# EAGLE design sensor_001 (EAGLE 4.15)
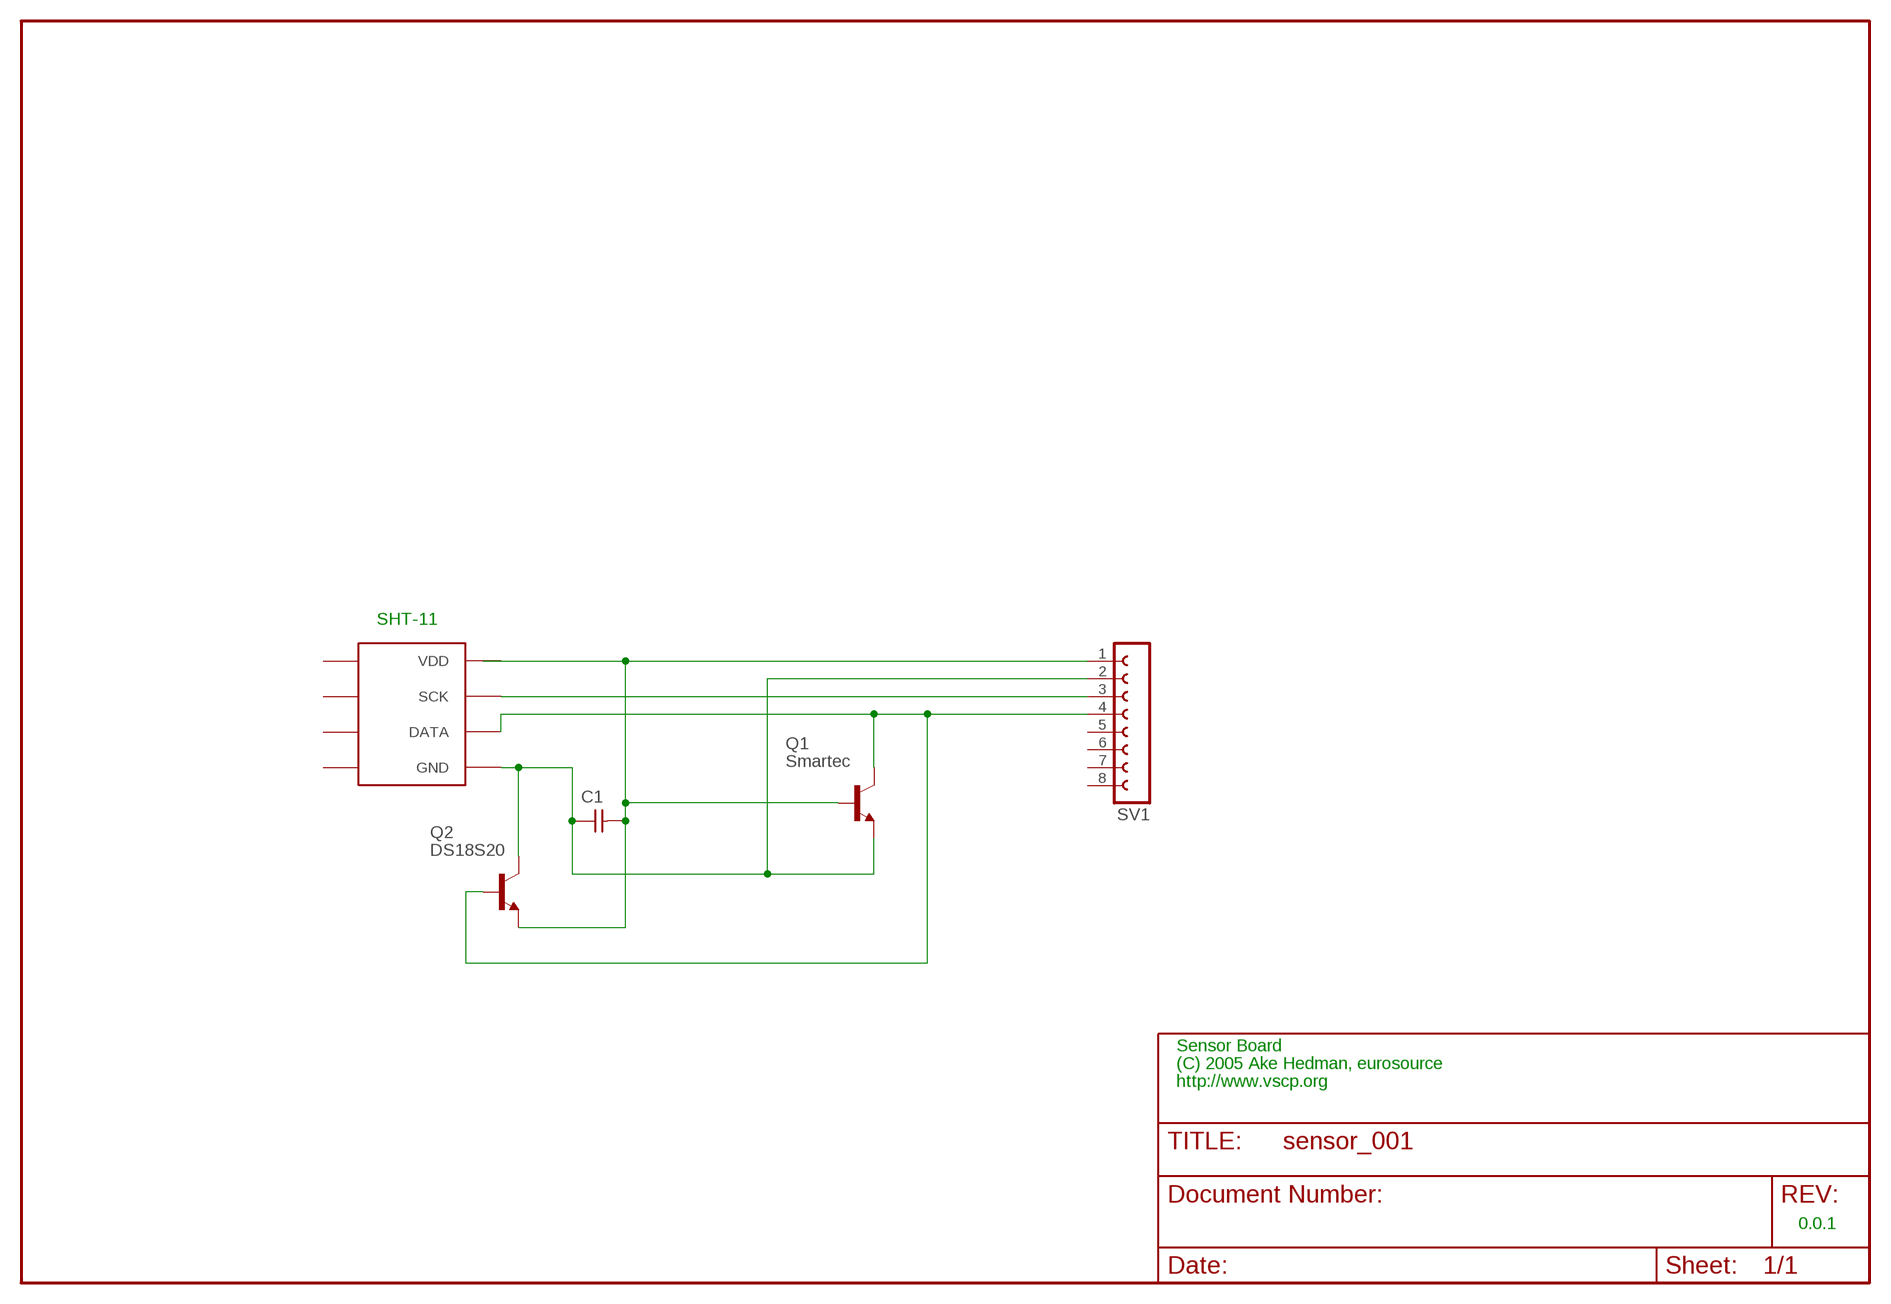
[diagram p0: schematic, sheet 1]

## Parts
C1  CAPNP-5  [C-5]
Q1  Smartec  BC548  [TO92-EBC]
Q2  DS18S20  BC548  [TO92-EBC]
SHT1  SHT11  [SHT11]
SV1  FE08-1  [FE08]

## Nets
GND: SHT1.SCK SV1.3
N$1: C1.2 Q1.B Q2.E SV1.1
N$2: C1.1 Q1.E Q2.C SHT1.GND SV1.2
N$4: Q1.C Q2.B SHT1.DATA SV1.4
Unconnected: SHT1.5 SHT1.6 SHT1.7 SHT1.8 SV1.5 SV1.6 SV1.7 SV1.8

## Notes on the sheet
- SHT-11
- Sensor Board
- (C) 2005 Ake Hedman, eurosource
- http://www.vscp.org
- 0.0.1

## Power pins joined to a net without a drawn wire
VDD: SHT1.VDD

## Library data of the parts
C1 = discrete:CAPNP-5
Q1 Q2 = transistor-npn:BC548*: NPN Transistor
SHT1 = sht11:SHT11
SV1 = con-lsta:FE08-1: FEMALE HEADER

## Board
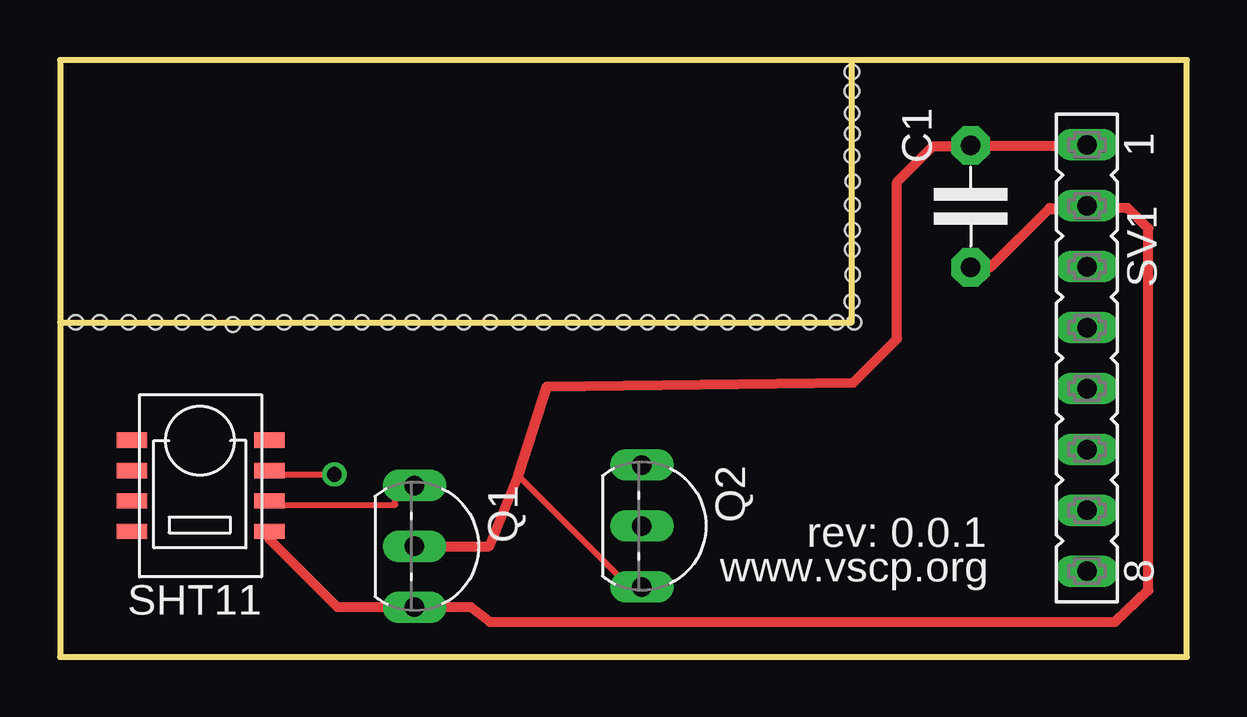
[diagram p1: board, top side]
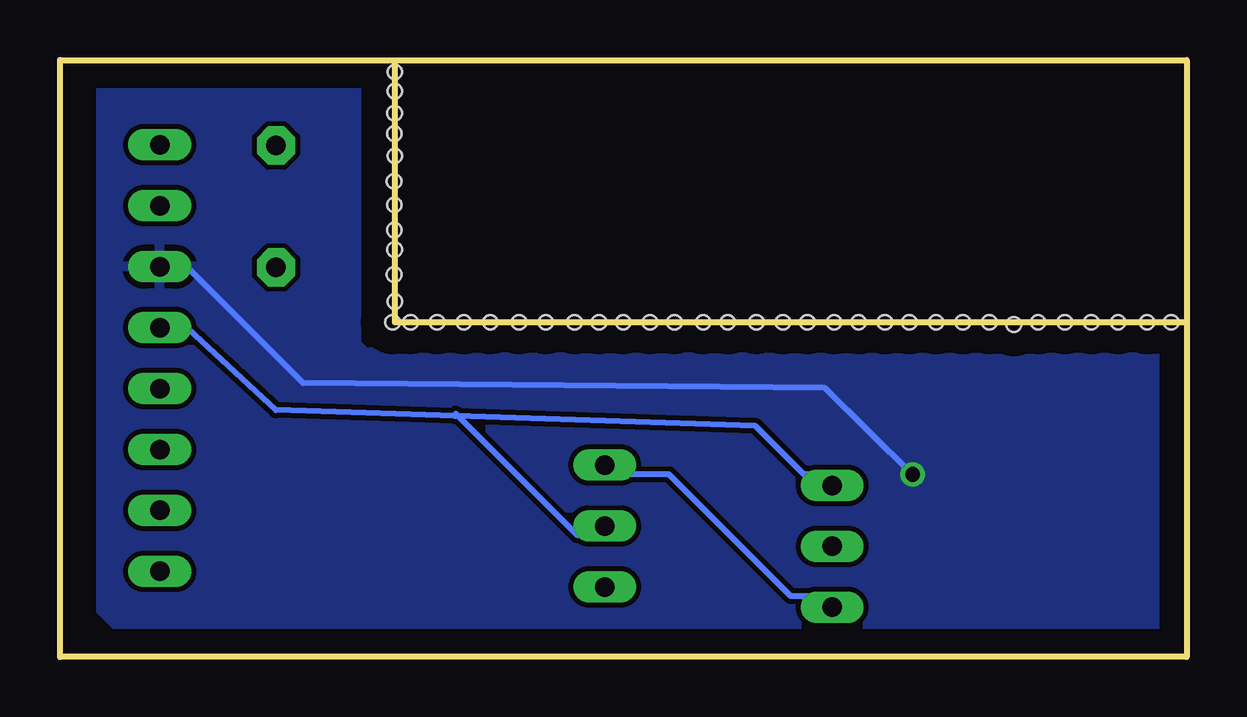
[diagram p2: board, bottom side, seen from below]

Size 46.97 x 24.89 mm. Coordinates in mm from the lower left corner, seen from the top.
Outline: 0,13.95 33.01,13.95 33.01,24.87
Outline: 0.01,0 46.97,0 46.97,24.89 0.01,24.89 0.01,0
Copper layers (1*16): Top 0.035mm / dielectric 1.5mm / Bottom 0.035mm
Design rules "default": minimum track width 10mil, minimum drill 24mil, track to track 8mil, track to pad 8mil, pad to pad 8mil, via to via 8mil, smd to smd 8mil, copper to edge 40mil, drill to drill 8mil, minimum pad ring 10mil, minimum via ring 8mil, stop-mask expansion 4mil, vias tented up to drill 0mil, thermal gap 10mil
Holes 0.6 mm at 33.01,23.59 33.1,13.95 33.01,14.82 33.02,16.98 33.03,17.79 33.03,18.85 33.04,19.83 33.01,20.89 33.03,21.82 33.02,22.67 0.65,13.95 1.66,13.95 2.87,13.95 3.98,13.95 5.09,13.95 6.2,13.95 7.21,13.86 8.23,13.95 9.34,13.95 10.45,13.95 11.56,13.95 12.58,13.95 13.68,13.95 14.7,13.95 15.81,13.95 16.83,13.95 17.94,13.95 19.14,13.95 20.16,13.95 21.36,13.95 22.38,13.95 23.49,13.95 24.5,13.95 25.52,13.95 26.72,13.95 27.83,13.95 29.03,13.95 30.14,13.95 31.25,13.95 32.36,13.95 33.01,24.39 33.04,15.94

### Footprints (pad centres in the part's own frame; a part is rotated, then mirrored left to right if it is on the bottom)
C-5 = drill 0.813 pad 1.6 octagon: 1 -2.54,0; 2 2.54,0
TO92-EBC = drill 0.813 long: B 0,-1.27; C -2.54,-1.27; E 2.54,-1.27
SHT11 = smd 1.27 x 0.635: 5 7.31,2.54; 6 7.31,3.81; 7 7.31,5.08; 8 7.31,6.35; DATA 1.59,5.08; GND 1.59,6.35; SCK 1.59,3.81; VDD 1.59,2.54
FE08 = drill 0.813 long: 1 -8.89,0; 2 -6.35,0; 3 -3.81,0; 4 -1.27,0; 5 1.27,0; 6 3.81,0; 7 6.35,0; 8 8.89,0

### Placement (x,y rotation side)
C1  37.96,18.78 90 top
Q1  16.05,4.61 270 top
Q2  25.53,5.46 270 top
SHT1  10.31,11.58 180 top
SV1  42.81,12.46 270 top

### Tracks (layer width: path | path; a pad name or v marks a point on that pad's centre or on a via)
GND  (via drill 0.61)
  Top 0.254: v11.43,7.61 8.89,7.61 SHT1.SCK
  Bottom 0.254: v11.43,7.61 15.08,11.21 36.83,11.42 41.91,16.5 SV1.3
  pour Bottom: 0.74,12.8 0.74,1.47 1.2,1.01 44.34,1.01 45.26,1.93 45.26,23.75 45.4,23.89 34.76,23.89 34.63,23.76 34.63,13.08 34.26,12.71
N$1
  Top 0.254: Q2.E 24.13,2.53 19.05,7.61 19.11,7.59
  Top 0.406: SV1.1 43.01,21.35 43.02,21.34 43,21.32 C1.2 38.19,21.32 | Q1.B 17.9,4.61 19.11,7.59 20.3,11.27 33.07,11.44 34.89,13.26 34.89,19.79 36.39,21.29 38.16,21.29 38.19,21.32 | 38.19,21.32 38.26,21.39
N$2
  Top 0.406: SHT1.GND 8.72,4.92 11.56,2.08 14.72,2.08 14.78,2.02 | 14.78,2.02 14.88,1.92 | 14.78,2.02 Q1.E 14.66,2.07 | 43,18.81 43.02,18.83 | 43,18.81 SV1.2 | 43,18.81 42.91,18.72 41.25,18.72 38.77,16.24 C1.1 38.78,16.24 41.2,18.66 42.96,18.66 43.02,18.72 44.51,18.72 45.37,17.86 45.37,2.77 43.98,1.46 17.92,1.46 17.12,2.08 14.67,2.08 14.66,2.07 | 14.66,2.07 14.61,2.02
  Bottom 0.254: Q2.C 24.13,7.61 21.59,7.61 16.51,2.53 15.24,2.53 Q1.E
N$4
  Top 0.254: SHT1.DATA 8.89,6.34 13.97,6.34 13.97,7.61 Q1.C
  Bottom 0.254: 30.48,10.04 17.98,9.62 15.97,7.61 15.24,7.61 Q1.C | 30.48,10.04 37.96,10.29 41.91,13.96 SV1.4 | Q2.B 25.4,5.07 30.48,10.15 30.48,10.04

### Text on the board
tNames: rev: 0.0.1 | www.vscp.org